# EasyEDA schematic Bravo-M7-Arduino Mega Shield.json

## Sheets
1 Bravo-M7-Arduino Mega Shield: TITLE: Bravo V1.0-M7-Arduino Shield; REV: 1.0; Date: 2021-11-23; Sheet: 1/2; Drawn By: Kaveh Majidi (CONFIG IOI)
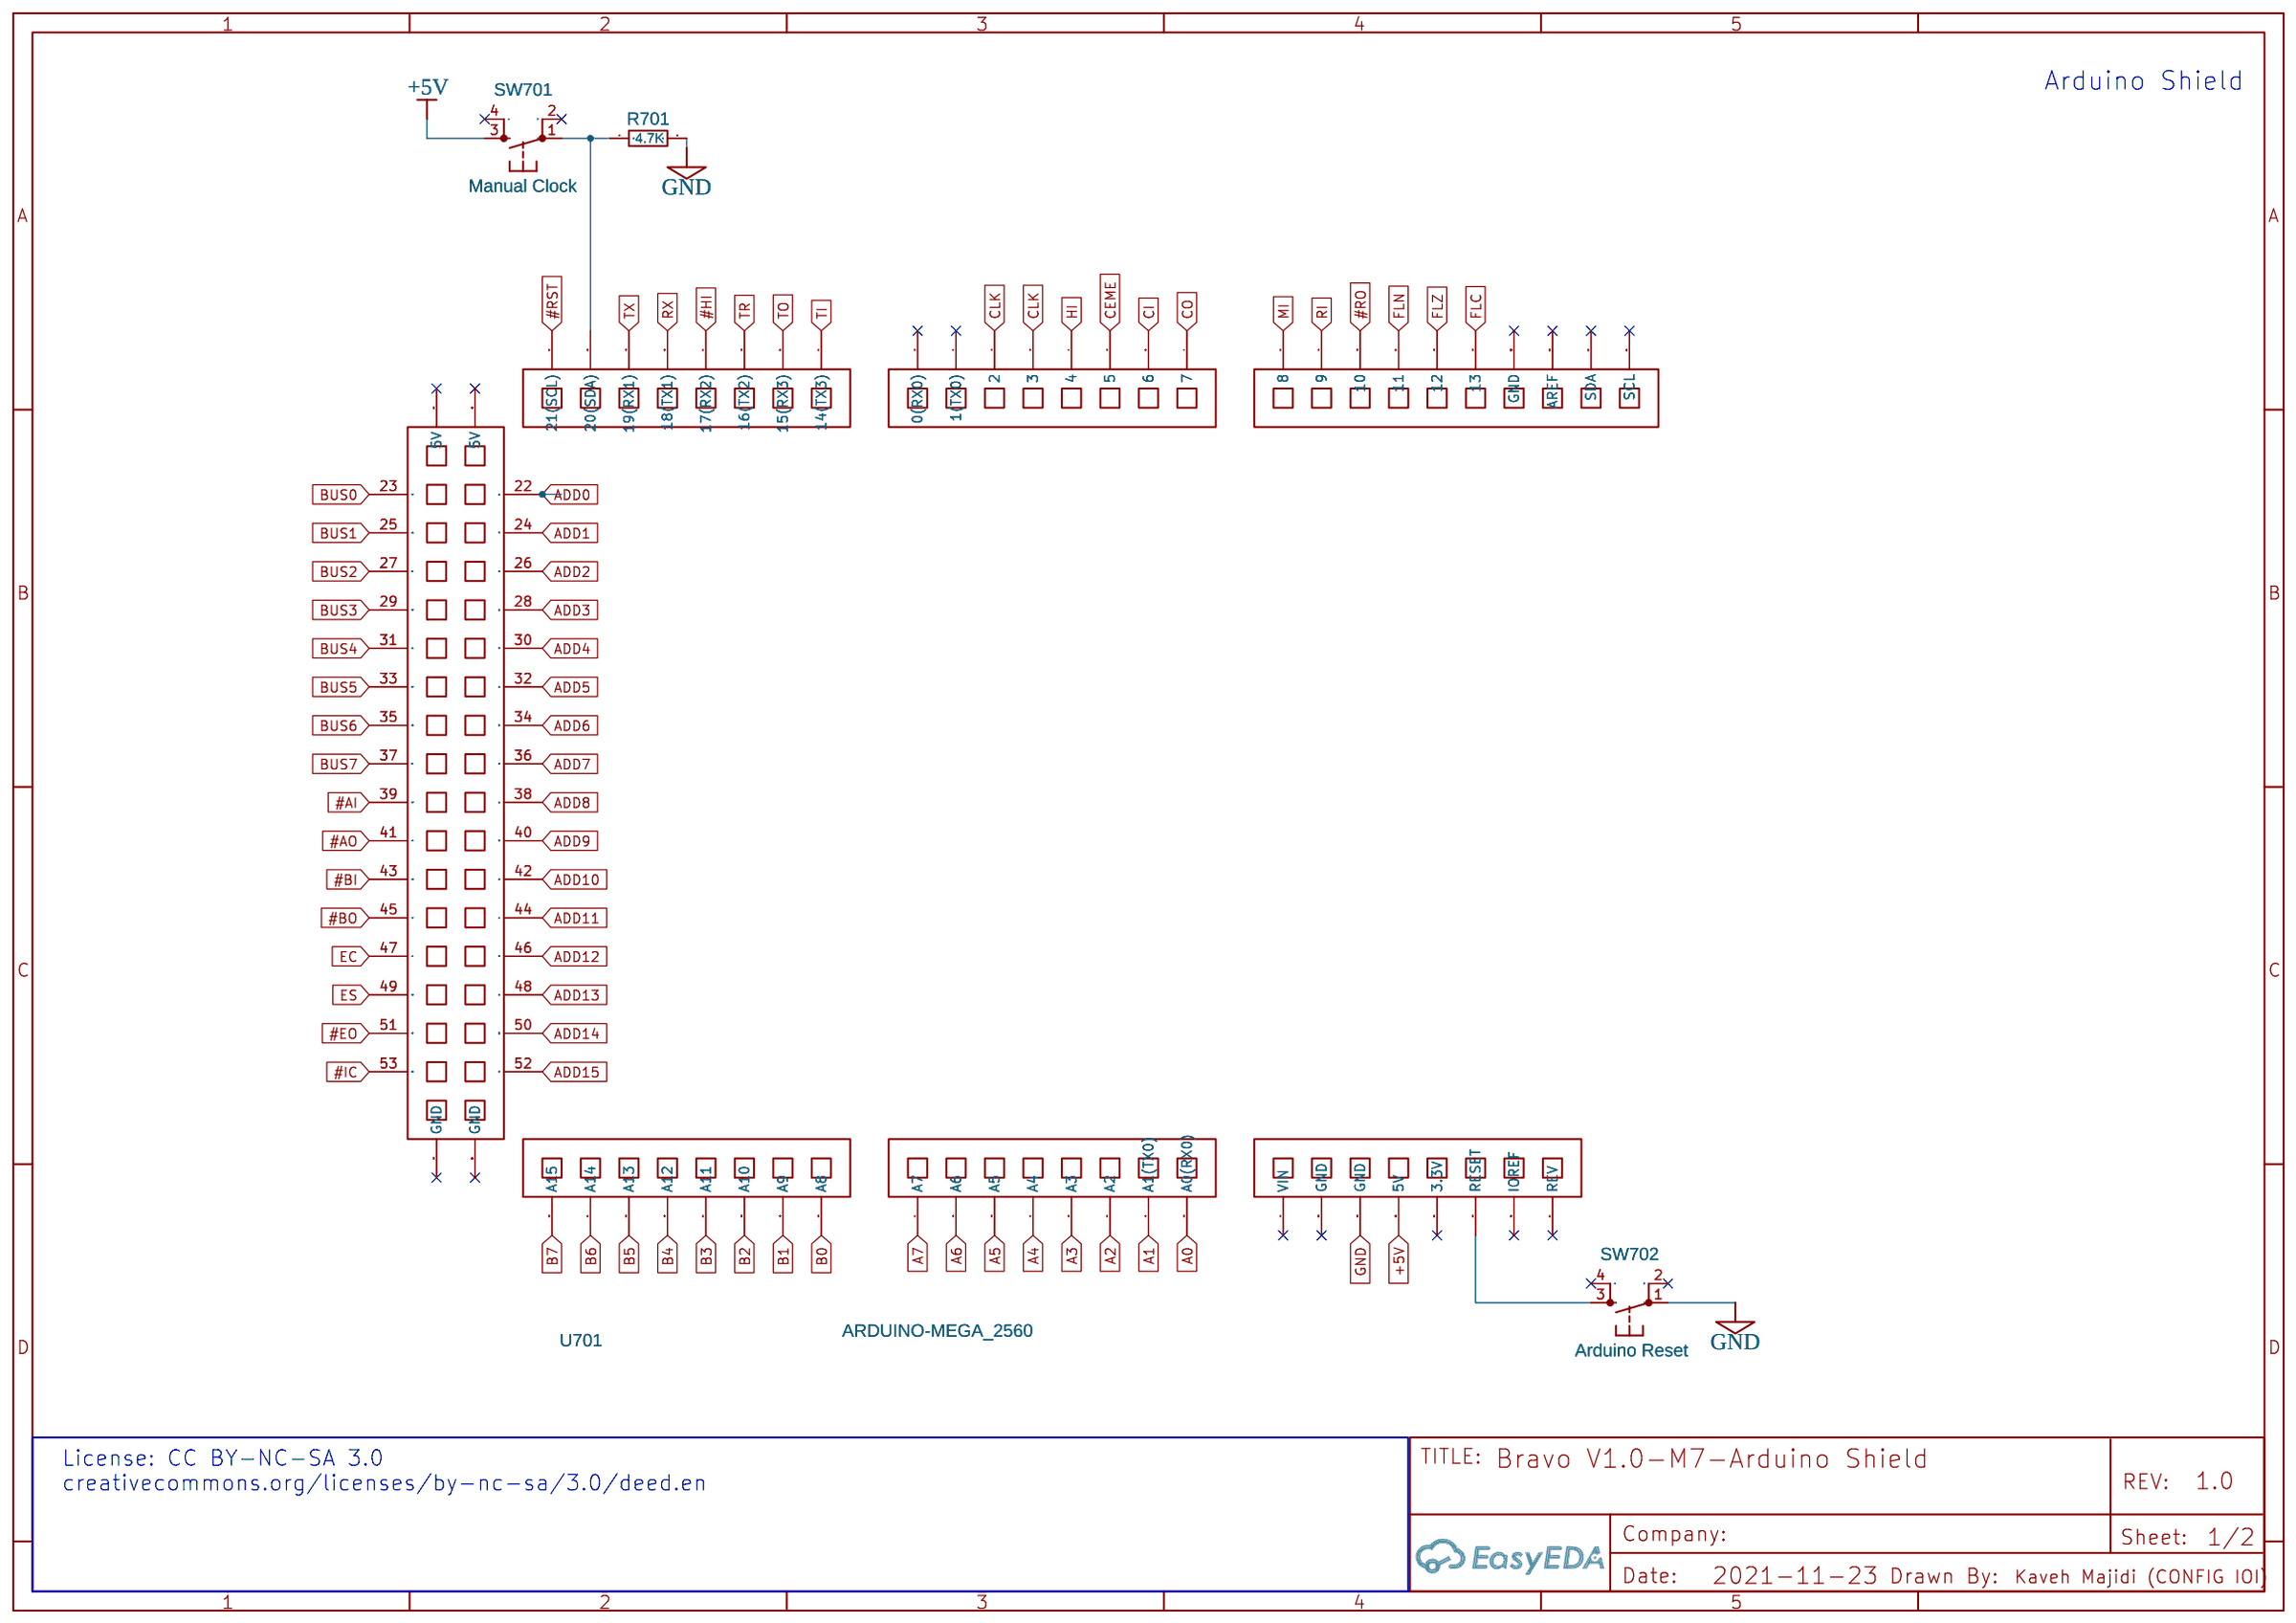
[diagram p0: Bravo-M7-Arduino Mega Shield]
2 Bravo-M7-Common: TITLE: Bravo V1.0-M7-Common; Sheet: 2/2
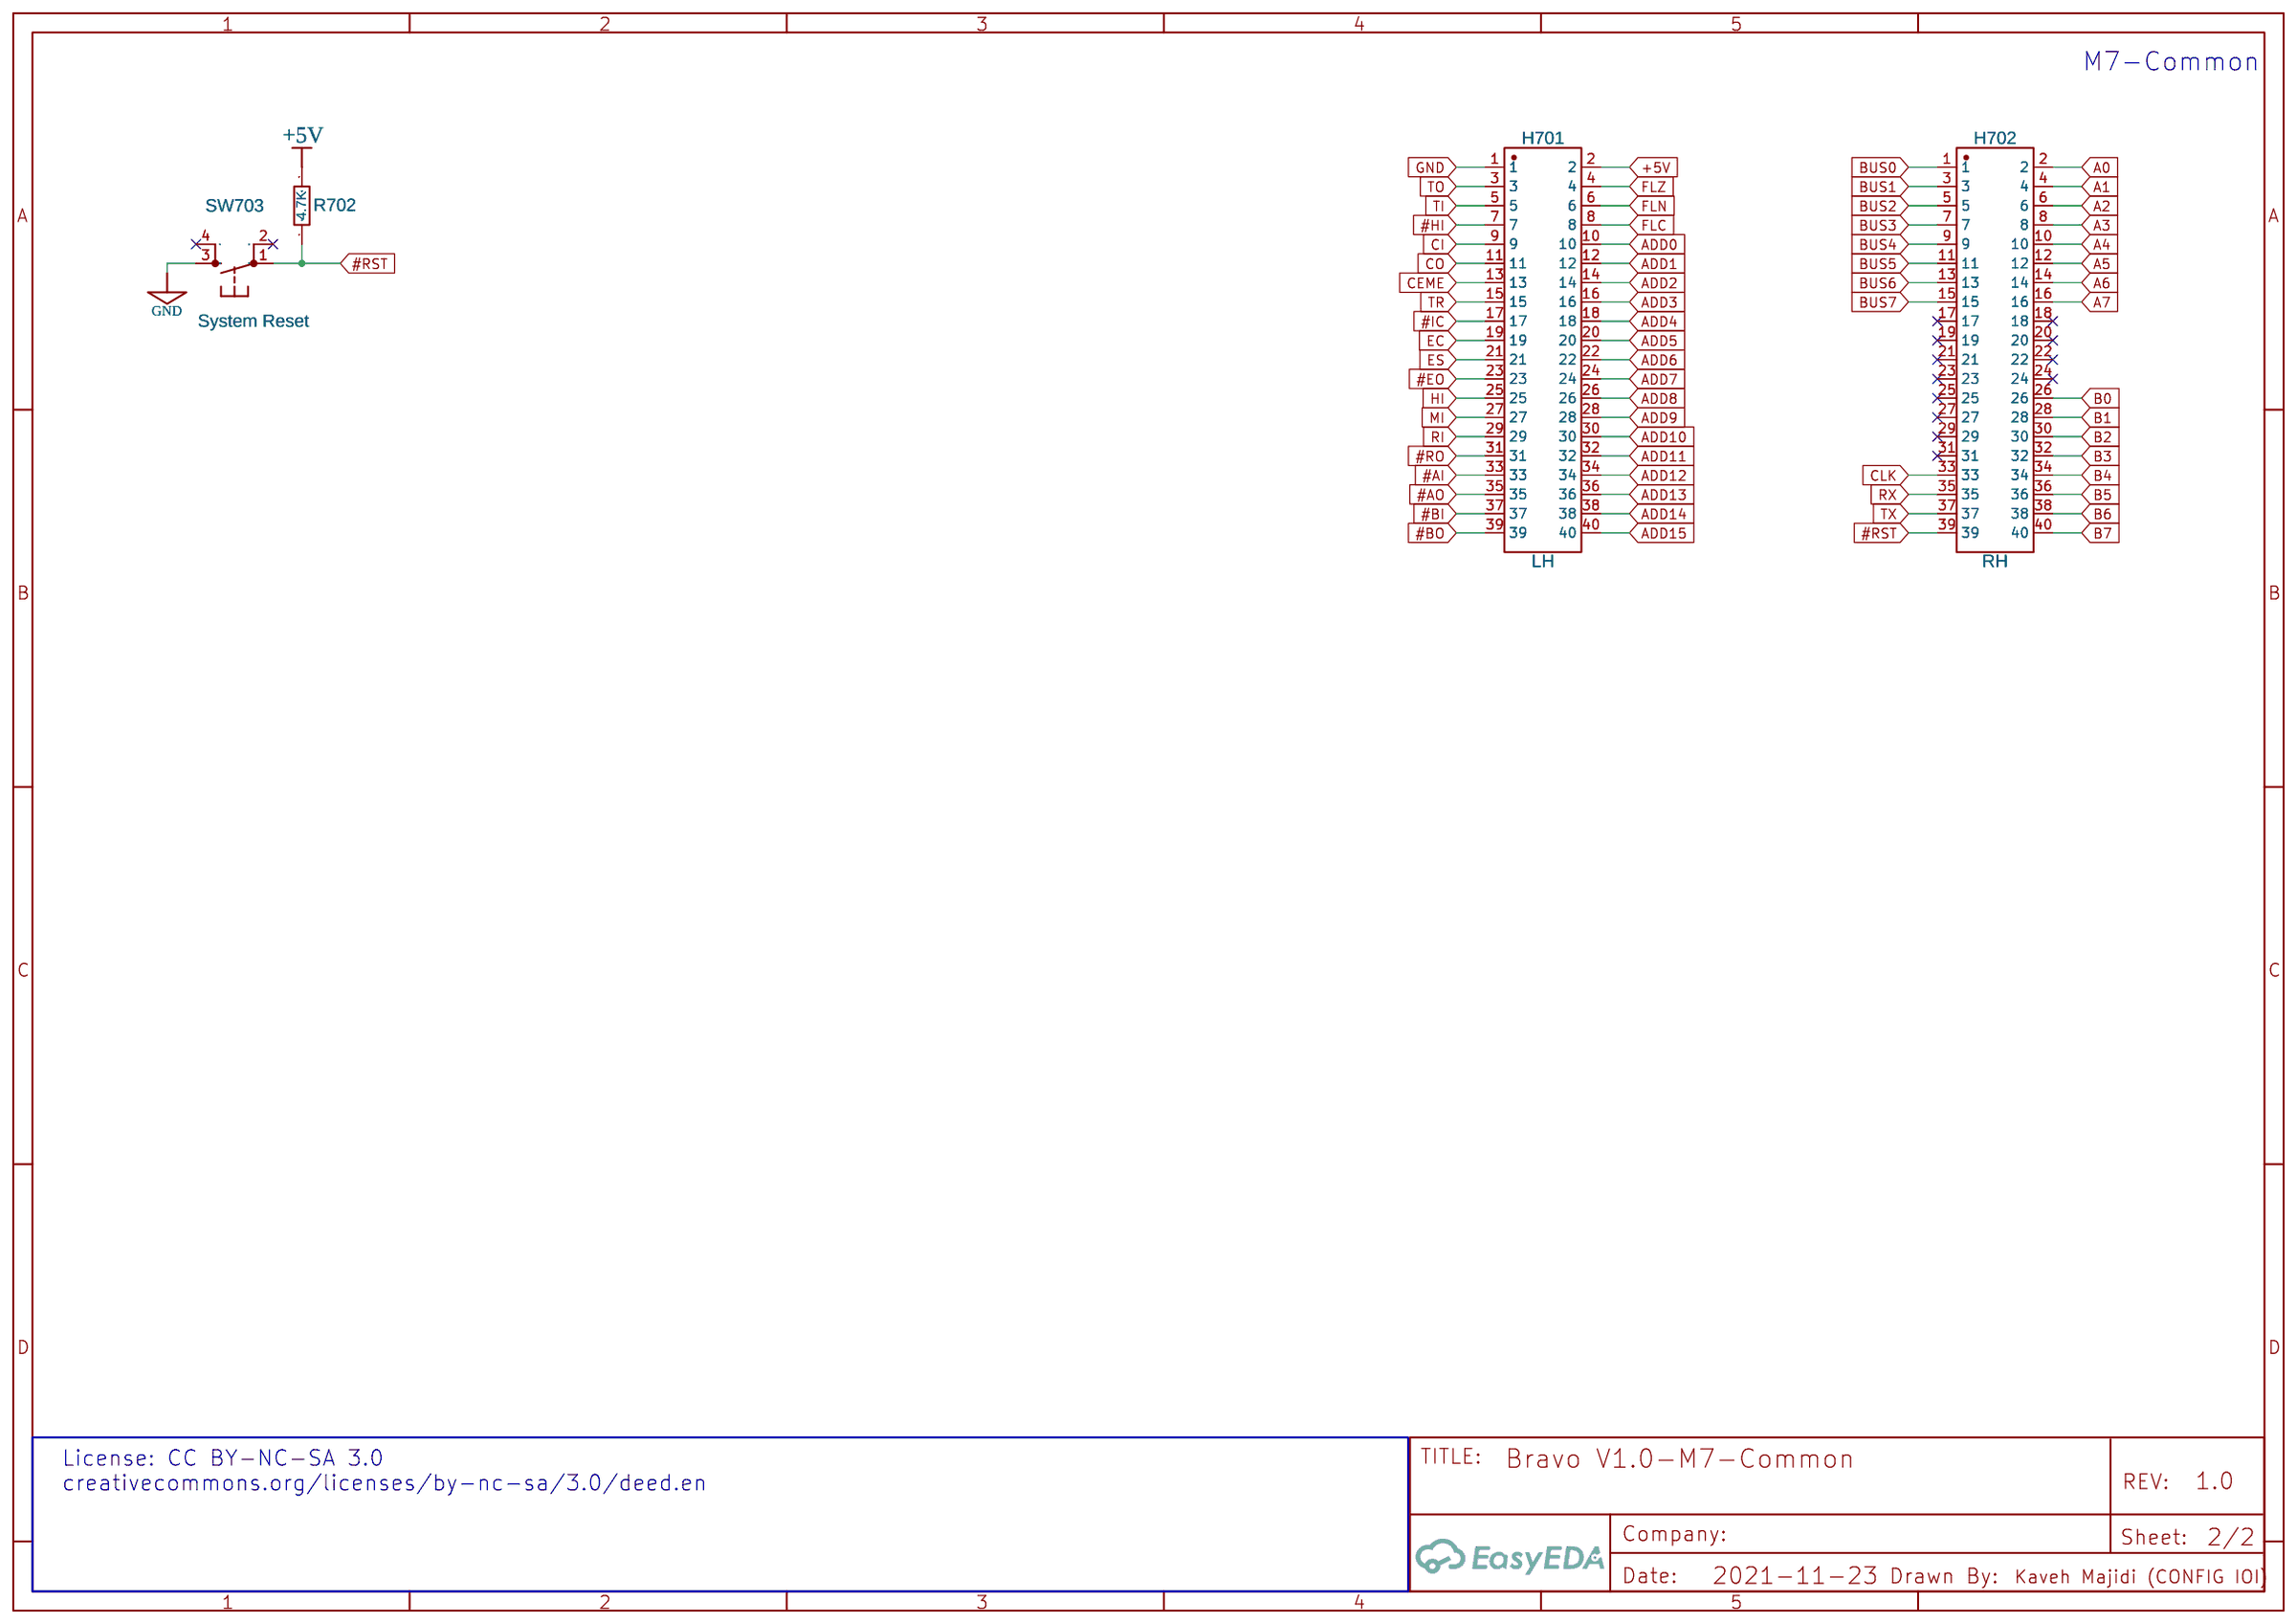
[diagram p1: Bravo-M7-Common]

## Parts
sheet Bravo-M7-Arduino Mega Shield
R701  4.7K  [AXIAL-0.4]
SW701  Manual Clock  [TACTILE-PTH]
SW702  Arduino Reset  [TACTILE-PTH]
U701  ARDUINO-MEGA_2560  [ARDUINO-MEGA2560]
sheet Bravo-M7-Common
H701  LH  [HEADER-2X20-2.54]
H702  RH  [HEADER-2X20-2.54]
R702  4.7K  [AXIAL-0.4]
SW703  System Reset  [TACTILE-PTH]

## Library data of the parts
R701 R702 = MF1/4W-10Ω±1% T52: Supplier: LCSC; Supplier Part: C119282; Manufacturer: Chian Chia Elec; Contributor: LCSC
SW701-SW703 = TAC_SWITCH: Contributor: SparkFun
U701 = ARDUINO-MEGA_2560: Arduino Mega board footprint; Contributor: biggrey54
H701 H702 = HEADER-2x20-2.54: Manufacturer Part: Headers  Pins2.54mm1*10P; image: http://image.lceda.cn/szlcsc/C57369.jpg; Supplier Part: C57369; Contributor: panasonic-spunt

## Nets
+5V: H701.2 R702.2 SW701.3 U701.5V@0(5V)
GND: H701.1 R701.2 SW702.1 SW703.3 U701.GND@1(GND)
#AI: H701.33 U701.39
#AO: H701.35 U701.41
#BI: H701.37 U701.43
#BO: H701.39 U701.45
#EO: H701.23 U701.51
#HI: H701.7 U701.17(17(RX2))
#IC: H701.17 U701.53
#RO: H701.31 U701.10
#RST: H702.39 R702.1 SW703.1 U701.21(21(SCL))
A0: H702.2 U701.A0(A0(RX0))
A1: H702.4 U701.A1(A1(TX0))
A2: H702.6 U701.A2
A3: H702.8 U701.A3
A4: H702.10 U701.A4
A5: H702.12 U701.A5
A6: H702.14 U701.A6
A7: H702.16 U701.A7
ADD0: H701.10 U701.22
ADD1: H701.12 U701.24
ADD2: H701.14 U701.26
ADD3: H701.16 U701.28
ADD4: H701.18 U701.30
ADD5: H701.20 U701.32
ADD6: H701.22 U701.34
ADD7: H701.24 U701.36
ADD8: H701.26 U701.38
ADD9: H701.28 U701.40
ADD10: H701.30 U701.42
ADD11: H701.32 U701.44
ADD12: H701.34 U701.46
ADD13: H701.36 U701.48
ADD14: H701.38 U701.50
ADD15: H701.40 U701.52
B0: H702.26 U701.A8
B1: H702.28 U701.A9
B2: H702.30 U701.A10
B3: H702.32 U701.A11
B4: H702.34 U701.A12
B5: H702.36 U701.A13
B6: H702.38 U701.A14
B7: H702.40 U701.A15
BUS0: H702.1 U701.23
BUS1: H702.3 U701.25
BUS2: H702.5 U701.27
BUS3: H702.7 U701.29
BUS4: H702.9 U701.31
BUS5: H702.11 U701.33
BUS6: H702.13 U701.35
BUS7: H702.15 U701.37
CEME: H701.13 U701.5
CI: H701.9 U701.6
CLK: H702.33 U701.2 U701.3
CO: H701.11 U701.7
EC: H701.19 U701.47
ES: H701.21 U701.49
FLC: H701.8 U701.13
FLN: H701.6 U701.11
FLZ: H701.4 U701.12
HI: H701.25 U701.4
MI: H701.27 U701.8
RI: H701.29 U701.9
RX: H702.35 U701.18(18(TX1))
TI: H701.5 U701.14(14(TX3))
TO: H701.3 U701.15(15(RX3))
TR: H701.15 U701.16(16(TX2))
TX: H702.37 U701.19(19(RX1))
Net-(R701-1): R701.1 SW701.1 U701.20(20(SDA))
Net-(SW702-3): SW702.3 U701.RESET

Not connected (* = marked no-connect by the designer): H702 17* 18* 19* 20* 21* 22* 23* 24* 25* 27* 29* 31*; SW701 2* 4*; SW702 2* 4*; SW703 2* 4*; U701 0(0(RX0))* 1(1(TX0))* 3.3V* 5V@1(5V)* 5V@2(5V)* AREF* GND@0(GND)* GND@2(GND)* GND@3(GND)* GND@4(GND)* IOREF* REV* SCL* SDA* VIN*

## Notes on the sheets
sheet 1
- Arduino Shield
- License: CC BY-NC-SA 3.0
  creativecommons.org/licenses/by-nc-sa/3.0/deed.en
sheet 2
- M7-Common
- License: CC BY-NC-SA 3.0
  creativecommons.org/licenses/by-nc-sa/3.0/deed.en
